# Altium project mother_board_project .PrjPcb
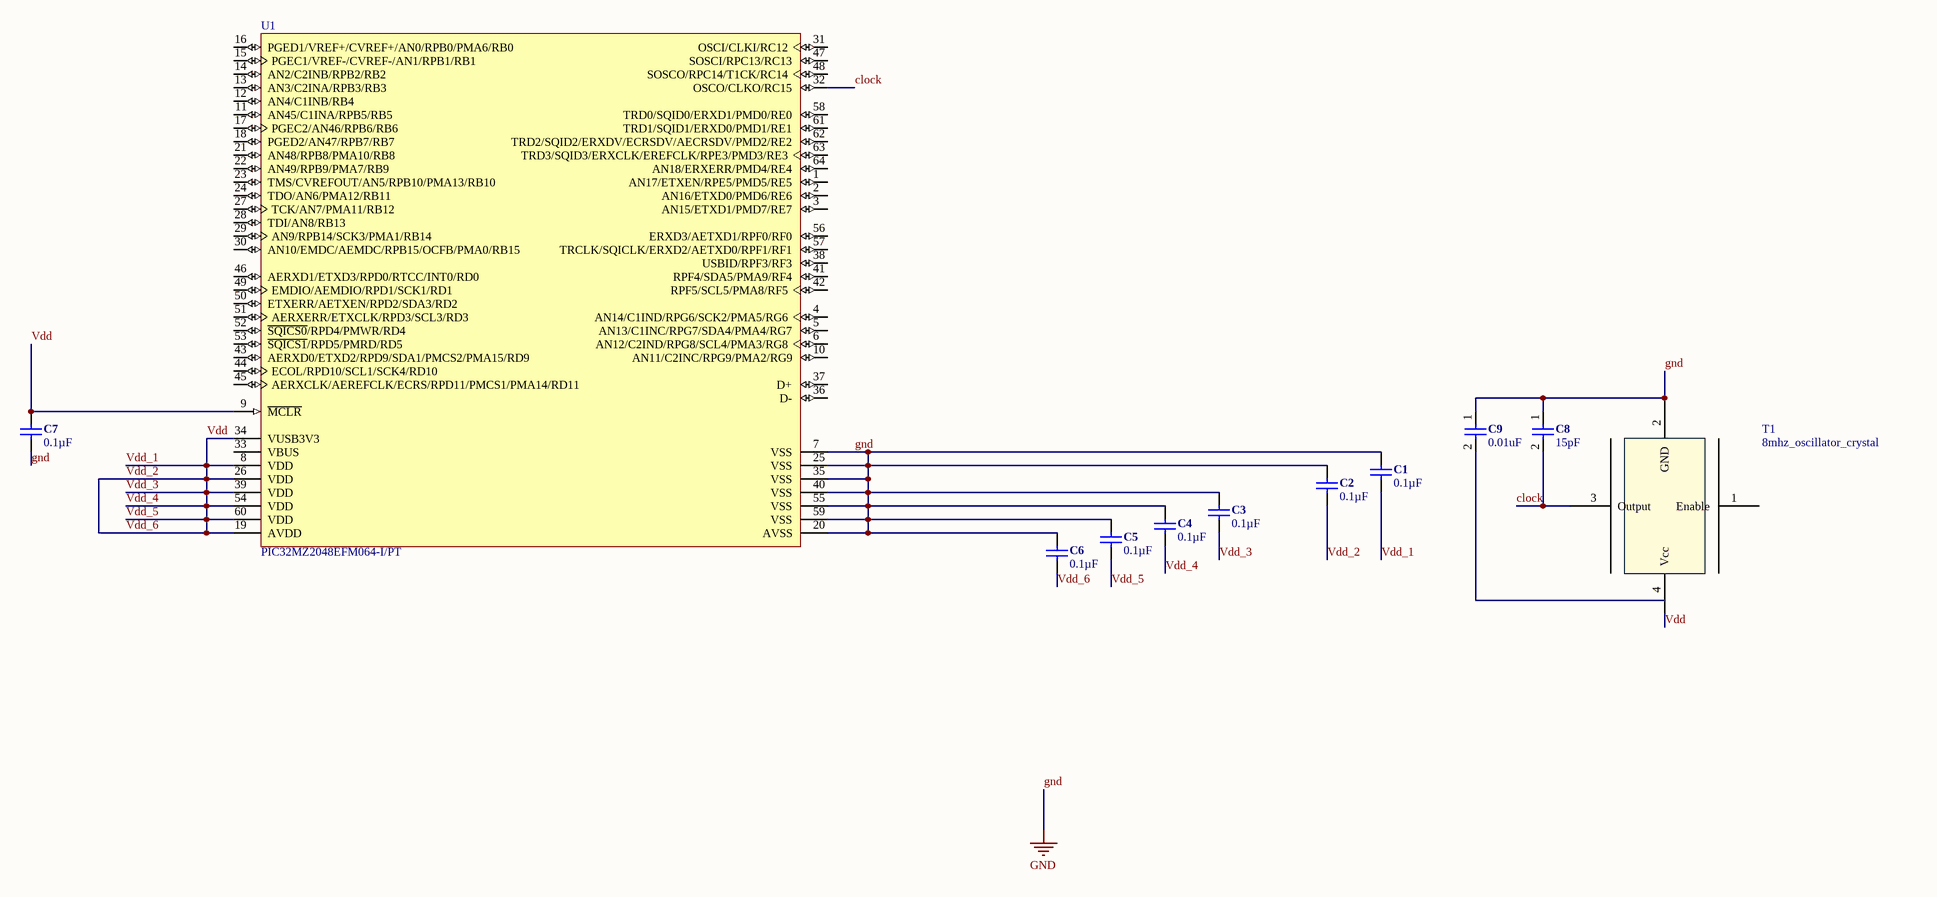
[diagram p0: design_1.SchDoc]
1 sheet, 11 parts. Net scope: global (net labels, ports and power ports of the same name join across sheets).

## Sheet design_1.SchDoc
size C

### Parts
C1  0.1µF  [CAP-0402(1005)-R]
C2  0.1µF  [CAP-0402(1005)-R]
C3  0.1µF  [CAP-0402(1005)-R]
C4  0.1µF  [CAP-0402(1005)-R]
C5  0.1µF  [CAP-0402(1005)-R]
C6  0.1µF  [CAP-0402(1005)-R]
C7  0.1µF  [CAP-0402(1005)-R]
C8  15pF  [CAP-15pF-25V-CER-0201(0603)]
C9  0.01uF  [CAP-0.01uF-25V-CER-0402(0603)]
T1  8mhz_oscillator_crystal
U1  PIC32MZ2048EFM064-I/PT  [TQFP-64]

### Nets
gnd: C1.1 C2.1 C3.1 C4.1 C5.1 C6.1 C7.2 C8.1 C9.1 T1.2(GND) U1.7(VSS) U1.20(AVSS) U1.25(VSS) U1.35(VSS) U1.40(VSS) U1.55(VSS) U1.59(VSS)
clock: C8.2 T1.3(Output) U1.32(OSCO/CLKO/RC15)
Vdd: C1.2 C2.2 C3.2 C4.2 C5.2 C6.2 C7.1 T1.4(Vcc) U1.8(VDD) U1.9(~{MCLR}) U1.19(AVDD) U1.26(VDD) U1.34(VUSB3V3) U1.39(VDD) U1.54(VDD) U1.60(VDD)  [also labelled Vdd_1, Vdd_2, Vdd_3, Vdd_4, Vdd_5, Vdd_6]

Not connected (* = marked no-connect by the designer): C9 2; T1 1(Enable); U1 1(AN17/ETXEN/RPE5/PMD5/RE5) 2(AN16/ETXD0/PMD6/RE6) 3(AN15/ETXD1/PMD7/RE7) 4(AN14/C1IND/RPG6/SCK2/PMA5/RG6) 5(AN13/C1INC/RPG7/SDA4/PMA4/RG7) 6(AN12/C2IND/RPG8/SCL4/PMA3/RG8) 10(AN11/C2INC/RPG9/PMA2/RG9) 11(AN45/C1INA/RPB5/RB5) 12(AN4/C1INB/RB4) 13(AN3/C2INA/RPB3/RB3) 14(AN2/C2INB/RPB2/RB2) 15(PGEC1/VREF-/CVREF-/AN1/RPB1/RB1) 16(PGED1/VREF+/CVREF+/AN0/RPB0/PMA6/RB0) 17(PGEC2/AN46/RPB6/RB6) 18(PGED2/AN47/RPB7/RB7) 21(AN48/RPB8/PMA10/RB8) 22(AN49/RPB9/PMA7/RB9) 23(TMS/CVREFOUT/AN5/RPB10/PMA13/RB10) 24(TDO/AN6/PMA12/RB11) 27(TCK/AN7/PMA11/RB12) 28(TDI/AN8/RB13) 29(AN9/RPB14/SCK3/PMA1/RB14) 30(AN10/EMDC/AEMDC/RPB15/OCFB/PMA0/RB15) 31(OSCI/CLKI/RC12) 33(VBUS) 36(D-) 37(D+) 38(USBID/RPF3/RF3) 41(RPF4/SDA5/PMA9/RF4) 42(RPF5/SCL5/PMA8/RF5) 43(AERXD0/ETXD2/RPD9/SDA1/PMCS2/PMA15/RD9) 44(ECOL/RPD10/SCL1/SCK4/RD10) 45(AERXCLK/AEREFCLK/ECRS/RPD11/PMCS1/PMA14/RD11) 46(AERXD1/ETXD3/RPD0/RTCC/INT0/RD0) 47(SOSCI/RPC13/RC13) 48(SOSCO/RPC14/T1CK/RC14) 49(EMDIO/AEMDIO/RPD1/SCK1/RD1) 50(ETXERR/AETXEN/RPD2/SDA3/RD2) 51(AERXERR/ETXCLK/RPD3/SCL3/RD3) 52(~{SQICS0}/RPD4/PMWR/RD4) 53(~{SQICS1}/RPD5/PMRD/RD5) 56(ERXD3/AETXD1/RPF0/RF0) 57(TRCLK/SQICLK/ERXD2/AETXD0/RPF1/RF1) 58(TRD0/SQID0/ERXD1/PMD0/RE0) 61(TRD1/SQID1/ERXD0/PMD1/RE1) 62(TRD2/SQID2/ERXDV/ECRSDV/AECRSDV/PMD2/RE2) 63(TRD3/SQID3/ERXCLK/EREFCLK/RPE3/PMD3/RE3) 64(AN18/ERXERR/PMD4/RE4)

### Notes on the sheet
- Title
- Size:
- Date:
- File:
- C
- Number:
- Time:
- Revision:
- Sheet
- of

### Library data of the parts
C1-C7 = CAP-0.1uF-16V-CER-0402(1005): CAP CER 0.1UF 16V 10% X7R 0402; Manufacturer: YAGEO; Manufacturering Number: CC0402KRX7R7BB104; RoHS: RoHS Compliant; Category: Capacitors; Capacitance: 0.1µF; Voltage - Rated: 16V; Tolerance: ±10%; Temperature Coefficient: X7R; Mounting Type: Surface Mount, MLCC; Applications: General Purpose; Package / Case: 0402 (1005 Metric); Size / Dimension: 0.063" L x 0.031" W (1.60mm x 0.80mm); Thickness (Max): 0.035" (0.90mm)
C8 = CAP-15pF-25V-CER-0201(0603): CAP CER 15pF 25V 5% C0G 0603 Murata; RoHS: RoHS Compliant; Category: Capacitors; Capacitance: 15pF; Voltage - Rated: 25V; Tolerance: ±5%; Temperature Coefficient: C0G; Mounting Type: Surface Mount, MLCC; Applications: General Purpose; Package / Case: 0201 (0603 Metric); Size / Dimension: 0.063" L x 0.031" W (1.60mm x 0.80mm); Thickness (Max): 0.035" (0.90mm)
C9 = CAP-0.01uF-25V-CER-0402(1005): CAP CER 0.01uF 25V 5% C0G 0402 yagoe; RoHS: RoHS Compliant; Category: Capacitors; Capacitance: 0.01uF; Voltage - Rated: 25V; Tolerance: ±5%; Temperature Coefficient: C0G; Mounting Type: Surface Mount, MLCC; Applications: General Purpose; Package / Case: 0402 (1005 Metric); Size / Dimension: 0.063" L x 0.031" W (1.60mm x 0.80mm); Thickness (Max): 0.035" (0.90mm)
U1 = PIC32MZ2048: 32-Bit Microcontroller with Audio and Graphics Interfaces, HS USB, Ethernet, and Advanced Analog, 1024 KB Program Memory, 53 I/O Pins, PMP, Extended Temperature, 64-Pin QFP (PT64), Tray; PartNumber: PIC32MZ1024ECG064-E/PT; Manufacturer: Microchip; VCC Range: 2.2 to 3.6 V; PackageVersion: C04-085B; DatasheetVersion: Rev. B; ComponentLink1URL: http://www.microchip.com/; ComponentLink2Description: Datasheet; Mounting Technology: Surface Mount; ComponentLink1Description: Manufacturer URL; Packing: Tray; PackageReference: QFP-PT64; PackageDescription: 64-Lead Plastic Thin Quad Flatpack, 10 x 10 mm Body, 0.5 mm Pitch; ComponentLink2URL: http://ww1.microchip.com/downloads/en/DeviceDoc/60001191B.pdf; ComponentLink3URL: http://ww1.microchip.com/downloads/en/DeviceDoc/60001191B.pdf; ComponentLink3Description: Package Specification